# Altium schematic sheet Relay schematic.SchDoc
size A4; Date: 24/10; Author: Rami Abdelmotalib; DocumentName: Relay circuit
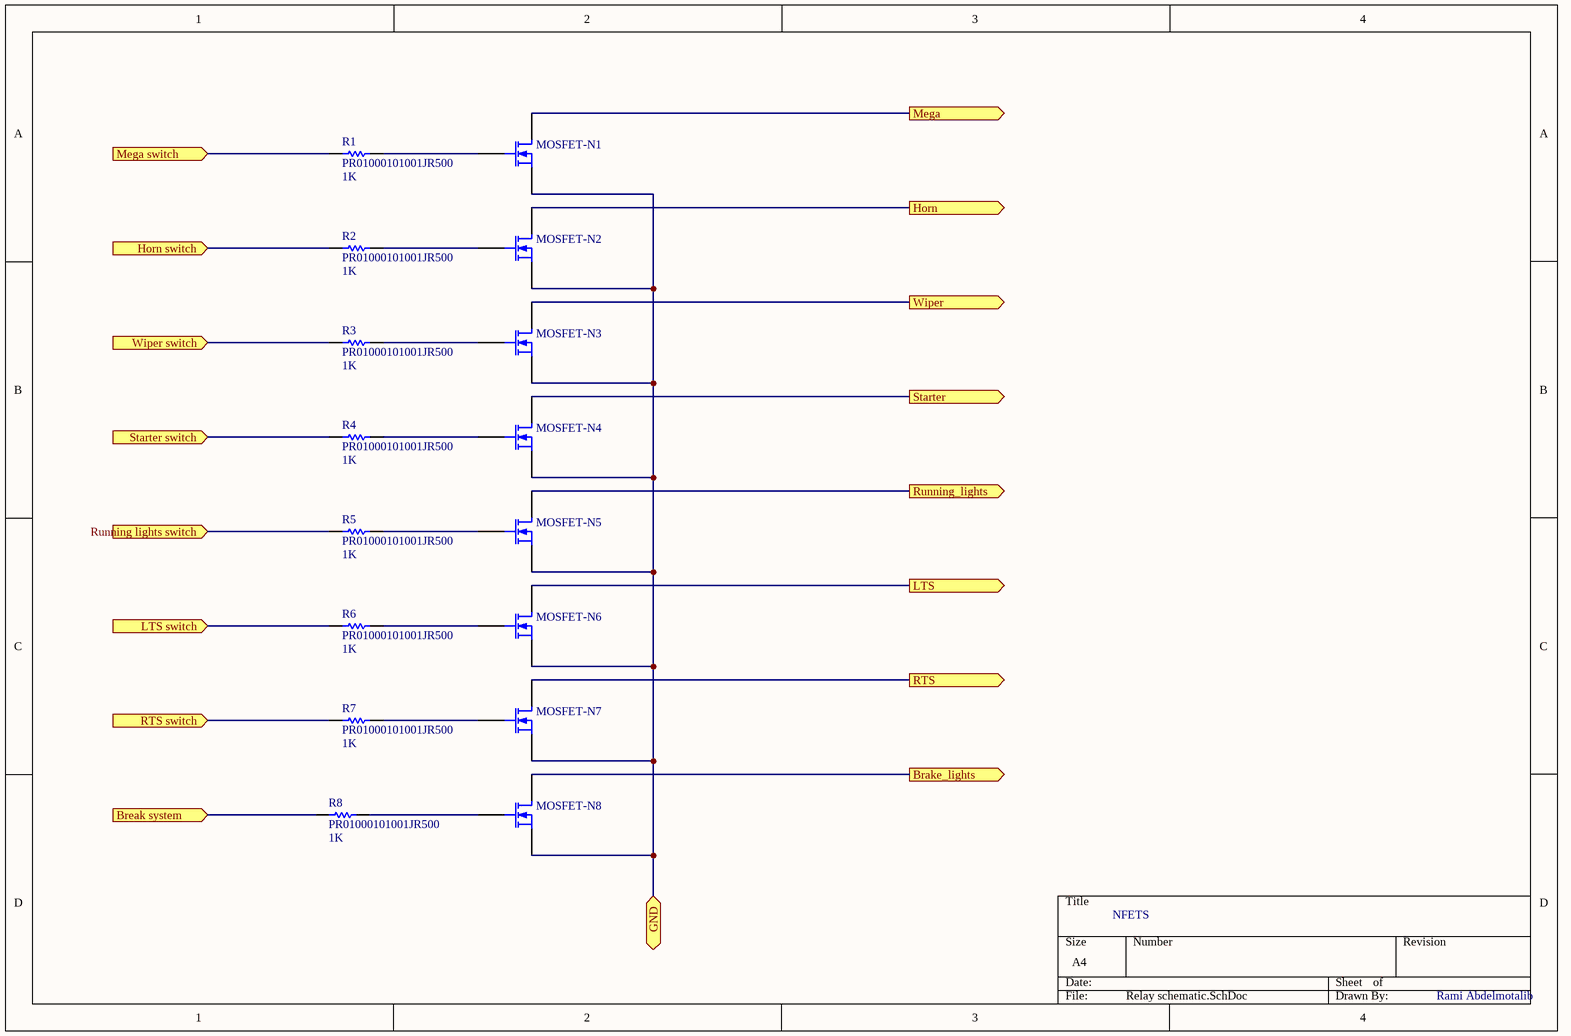
[diagram p0: Relay schematic.SchDoc]

## Parts
MOSFET-N1  (no value)  [D2pakMOSFET]
MOSFET-N2  (no value)  [D2pakMOSFET]
MOSFET-N3  (no value)  [D2pakMOSFET]
MOSFET-N4  (no value)  [D2pakMOSFET]
MOSFET-N5  (no value)  [D2pakMOSFET]
MOSFET-N6  (no value)  [D2pakMOSFET]
MOSFET-N7  (no value)  [D2pakMOSFET]
MOSFET-N8  (no value)  [D2pakMOSFET]
R1  PR01000101001JR500  value 1K  [AXIAL-0.3]
R2  PR01000101001JR500  value 1K  [AXIAL-0.3]
R3  PR01000101001JR500  value 1K  [AXIAL-0.3]
R4  PR01000101001JR500  value 1K  [AXIAL-0.3]
R5  PR01000101001JR500  value 1K  [AXIAL-0.3]
R6  PR01000101001JR500  value 1K  [AXIAL-0.3]
R7  PR01000101001JR500  value 1K  [AXIAL-0.3]
R8  PR01000101001JR500  value 1K  [AXIAL-0.3]

## Ports
Brake_lights (out), Break system (in), GND (bidir), Horn (out), Horn switch (in), LTS (out), LTS switch (in), Mega (out), Mega switch (in), RTS (out), RTS switch (in), Running lights switch (in), Running_lights (out), Starter (out), Starter switch (in), Wiper (out), Wiper switch (in)

## Nets
Brake_lights: MOSFET-N8.1(D) ; port Brake_lights
Break system: R8.1 ; port Break system
GND: MOSFET-N1.3(S) MOSFET-N2.3(S) MOSFET-N3.3(S) MOSFET-N4.3(S) MOSFET-N5.3(S) MOSFET-N6.3(S) MOSFET-N7.3(S) MOSFET-N8.3(S) ; port GND
Horn: MOSFET-N2.1(D) ; port Horn
Horn switch: R2.1 ; port Horn switch
LTS: MOSFET-N6.1(D) ; port LTS
LTS switch: R6.1 ; port LTS switch
Mega: MOSFET-N1.1(D) ; port Mega
Mega switch: R1.1 ; port Mega switch
RTS: MOSFET-N7.1(D) ; port RTS
RTS switch: R7.1 ; port RTS switch
Running lights switch: R5.1 ; port Running lights switch
Running_lights: MOSFET-N5.1(D) ; port Running_lights
Starter: MOSFET-N4.1(D) ; port Starter
Starter switch: R4.1 ; port Starter switch
Wiper: MOSFET-N3.1(D) ; port Wiper
Wiper switch: R3.1 ; port Wiper switch
NetMOSFET-N1_2: MOSFET-N1.2(G) R1.2
NetMOSFET-N2_2: MOSFET-N2.2(G) R2.2
NetMOSFET-N3_2: MOSFET-N3.2(G) R3.2
NetMOSFET-N4_2: MOSFET-N4.2(G) R4.2
NetMOSFET-N5_2: MOSFET-N5.2(G) R5.2
NetMOSFET-N6_2: MOSFET-N6.2(G) R6.2
NetMOSFET-N7_2: MOSFET-N7.2(G) R7.2
NetMOSFET-N8_2: MOSFET-N8.2(G) R8.2

## Notes on the sheet
- NFETS
- Rami Abdelmotalib

## Library data of the parts
MOSFET-N1-MOSFET-N8 = MOSFET-N: N-Channel MOSFET; Published: 8-Jun-2000; LatestRevisionDate: 17-Jul-2002; LatestRevisionNote: Re-released for DXP Platform.; PackageVersion: 1995/1996; PackageReference: E3; Publisher: Altium Limited; PackageDescription: TO, Flat Index; 3 In-Line, Axial Leads; Body Dia. 4.6mm; Lead Dia. 0.5 mm (max)
R1-R8 = Res1: Resistor; Published: 8-Jun-2000; LatestRevisionDate: 17-Jul-2002; LatestRevisionNote: Re-released for DXP Platform.; PackageReference: AXIAL-0.3; Publisher: Altium Limited; PackageDescription: Axial Device, Thru-Hole; 2 Leads; 0.3 in Pin Spacing